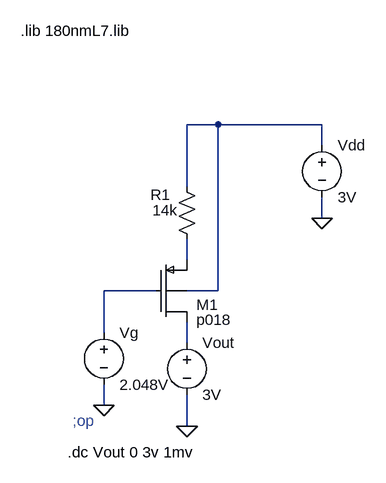
[diagram p0: schematic srs-cascoda-MOS.asc]
srs-cascoda-MOS.asc, the LTspice schematic file:
Version 4
SHEET 1 880 820
WIRE -80 192 -128 192
WIRE 80 192 -80 192
WIRE 80 224 80 192
WIRE -128 288 -128 192
WIRE 80 336 80 304
WIRE -128 400 -128 368
WIRE -176 448 -256 448
WIRE -80 448 -80 192
WIRE -80 448 -128 448
WIRE -256 512 -256 448
WIRE -128 528 -128 496
WIRE -256 624 -256 592
WIRE -128 656 -128 608
FLAG 80 336 0
FLAG -256 624 0
FLAG -128 656 0
SYMBOL voltage 80 208 R0
WINDOW 123 0 0 Left 2
WINDOW 39 0 0 Left 2
SYMATTR InstName Vdd
SYMATTR Value 3V
SYMBOL voltage -256 496 R0
WINDOW 123 0 0 Left 2
WINDOW 39 0 0 Left 2
SYMATTR InstName Vg
SYMATTR Value 2.048V
SYMBOL pmosb -176 400 R0
SYMATTR InstName M1
SYMATTR Value2 l=1u w=8.23u ad=1.1p as=1.1p pd=11.4u ps=11.4u m=1
SYMATTR Value p018
SYMBOL res -144 272 R0
WINDOW 0 -40 28 Left 2
WINDOW 3 -37 52 Left 2
SYMATTR InstName R1
SYMATTR Value 14k
SYMBOL voltage -128 512 R0
WINDOW 123 0 0 Left 0
WINDOW 39 0 0 Left 0
SYMATTR InstName Vout
SYMATTR Value 3V
TEXT -384 48 Left 2 !.lib 180nmL7.lib
TEXT -304 648 Left 2 ;;op
TEXT -312 696 Left 2 !.dc Vout 0 3v 1mv

The netlist it stands for:
* srs-cascoda-MOS.asc
Vdd N001 0 3V
Vg N003 0 2.048V
M1 N004 N003 N002 N001 p018 l=1u w=8.23u ad=1.1p as=1.1p pd=11.4u ps=11.4u m=1
R1 N001 N002 14k
Vout N004 0 3V
.model NMOS NMOS
.model PMOS PMOS
.lib standard.mos
.lib 180nmL7.lib
* ;op
.dc Vout 0 3v 1mv
.backanno
.end